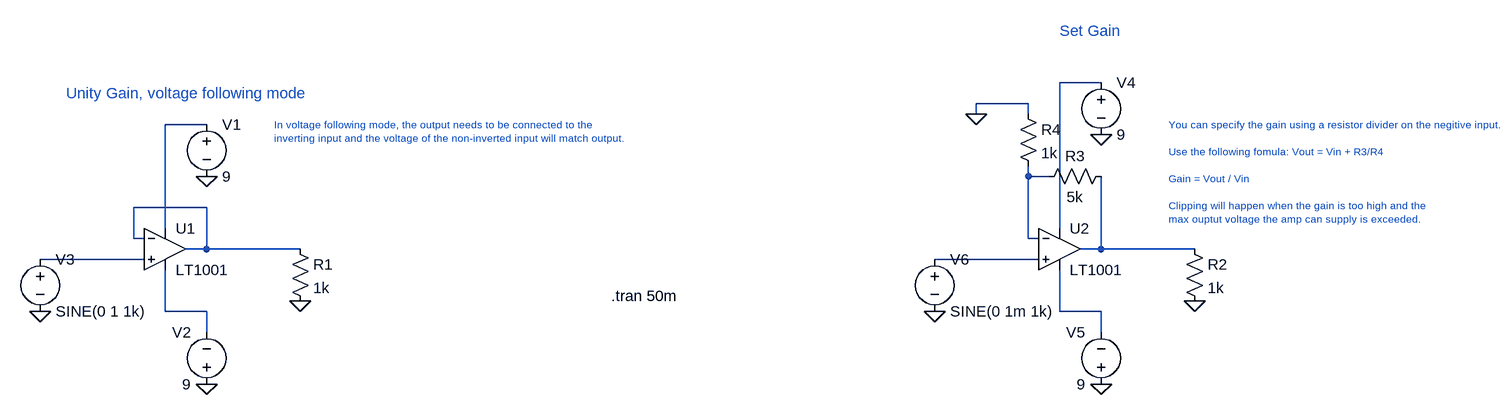
[diagram p0: schematic AudioAmplifier.asc]
AudioAmplifier.asc, the LTspice schematic file:
Version 4
SHEET 1 2324 680
WIRE 1632 -64 1568 -64
WIRE 1520 -32 1440 -32
WIRE 1440 -16 1440 -32
WIRE 1520 -16 1520 -32
WIRE 256 0 192 0
WIRE 1520 80 1520 64
WIRE 1552 80 1520 80
WIRE 256 128 144 128
WIRE 192 160 192 0
WIRE 1568 160 1568 -64
WIRE 144 176 144 128
WIRE 160 176 144 176
WIRE 1520 176 1520 80
WIRE 1536 176 1520 176
WIRE 256 192 256 128
WIRE 256 192 224 192
WIRE 400 192 256 192
WIRE 1632 192 1632 80
WIRE 1632 192 1600 192
WIRE 1776 192 1632 192
WIRE 160 208 0 208
WIRE 1536 208 1376 208
WIRE 192 288 192 224
WIRE 256 288 192 288
WIRE 1568 288 1568 224
WIRE 1632 288 1568 288
WIRE 256 320 256 288
WIRE 1632 320 1632 288
FLAG 400 272 0
FLAG 256 400 0
FLAG 256 80 0
FLAG 0 288 0
FLAG 1776 272 0
FLAG 1632 400 0
FLAG 1632 16 0
FLAG 1376 288 0
FLAG 1440 -16 0
SYMBOL OpAmps\\LT1001 192 128 R0
SYMATTR InstName U1
SYMBOL voltage 256 -16 R0
WINDOW 123 0 0 Left 0
WINDOW 39 0 0 Left 0
SYMATTR InstName V1
SYMATTR Value 9
SYMBOL voltage 256 416 R180
WINDOW 0 24 96 Left 2
WINDOW 3 24 16 Left 2
WINDOW 123 0 0 Left 0
WINDOW 39 0 0 Left 0
SYMATTR InstName V2
SYMATTR Value 9
SYMBOL res 384 176 R0
SYMATTR InstName R1
SYMATTR Value 1k
SYMBOL voltage 0 192 R0
WINDOW 123 0 0 Left 0
WINDOW 39 0 0 Left 0
SYMATTR InstName V3
SYMATTR Value SINE(0 1 1k)
SYMBOL OpAmps\\LT1001 1568 128 R0
SYMATTR InstName U2
SYMBOL voltage 1632 -80 R0
WINDOW 123 0 0 Left 0
WINDOW 39 0 0 Left 0
SYMATTR InstName V4
SYMATTR Value 9
SYMBOL voltage 1632 416 R180
WINDOW 0 24 96 Left 2
WINDOW 3 24 16 Left 2
WINDOW 123 0 0 Left 0
WINDOW 39 0 0 Left 0
SYMATTR InstName V5
SYMATTR Value 9
SYMBOL res 1760 176 R0
SYMATTR InstName R2
SYMATTR Value 1k
SYMBOL voltage 1376 192 R0
WINDOW 123 0 0 Left 0
WINDOW 39 0 0 Left 0
SYMATTR InstName V6
SYMATTR Value SINE(0 1m 1k)
SYMBOL res 1648 64 R90
WINDOW 0 0 56 VBottom 2
WINDOW 3 32 56 VTop 2
SYMATTR InstName R3
SYMATTR Value 5k
SYMBOL res 1504 -32 R0
SYMATTR InstName R4
SYMATTR Value 1k
TEXT 40 -48 Left 2 ;Unity Gain, voltage following mode
TEXT 878 264 Left 2 !.tran 50m
TEXT 360 0 Left 1 ;In voltage following mode, the output needs to be connected to the \ninverting input and the voltage of the non-inverted input will match output.
TEXT 1568 -144 Left 2 ;Set Gain
TEXT 1736 0 Left 1 ;You can specify the gain using a resistor divider on the negitive input.\n \nUse the following fomula: Vout = Vin + R3/R4\n \nGain = Vout / Vin\n \nClipping will happen when the gain is too high and the\nmax ouptut voltage the amp can supply is exceeded.

The netlist it stands for:
* AudioAmplifier.asc
XU1 N006 N004 N002 N008 N004 LT1001  ; pins In+ In- V+ V- OUT
V1 N002 0 9
V2 0 N008 9
R1 N004 0 1k
V3 N006 0 SINE(0 1 1k)
XU2 N007 N003 N001 N009 N005 LT1001  ; pins In+ In- V+ V- OUT
V4 N001 0 9
V5 0 N009 9
R2 N005 0 1k
V6 N007 0 SINE(0 1m 1k)
R3 N005 N003 5k
R4 0 N003 1k
* Unity Gain, voltage following mode
.tran 50m
* In voltage following mode, the output needs to be connected to the
* inverting input and the voltage of the non-inverted input will match output.
* Set Gain
* You can specify the gain using a resistor divider on the negitive input.
* Use the following fomula: Vout = Vin + R3/R4
* Gain = Vout / Vin
* Clipping will happen when the gain is too high and the
* max ouptut voltage the amp can supply is exceeded.
.lib LTC.lib
.backanno
.end